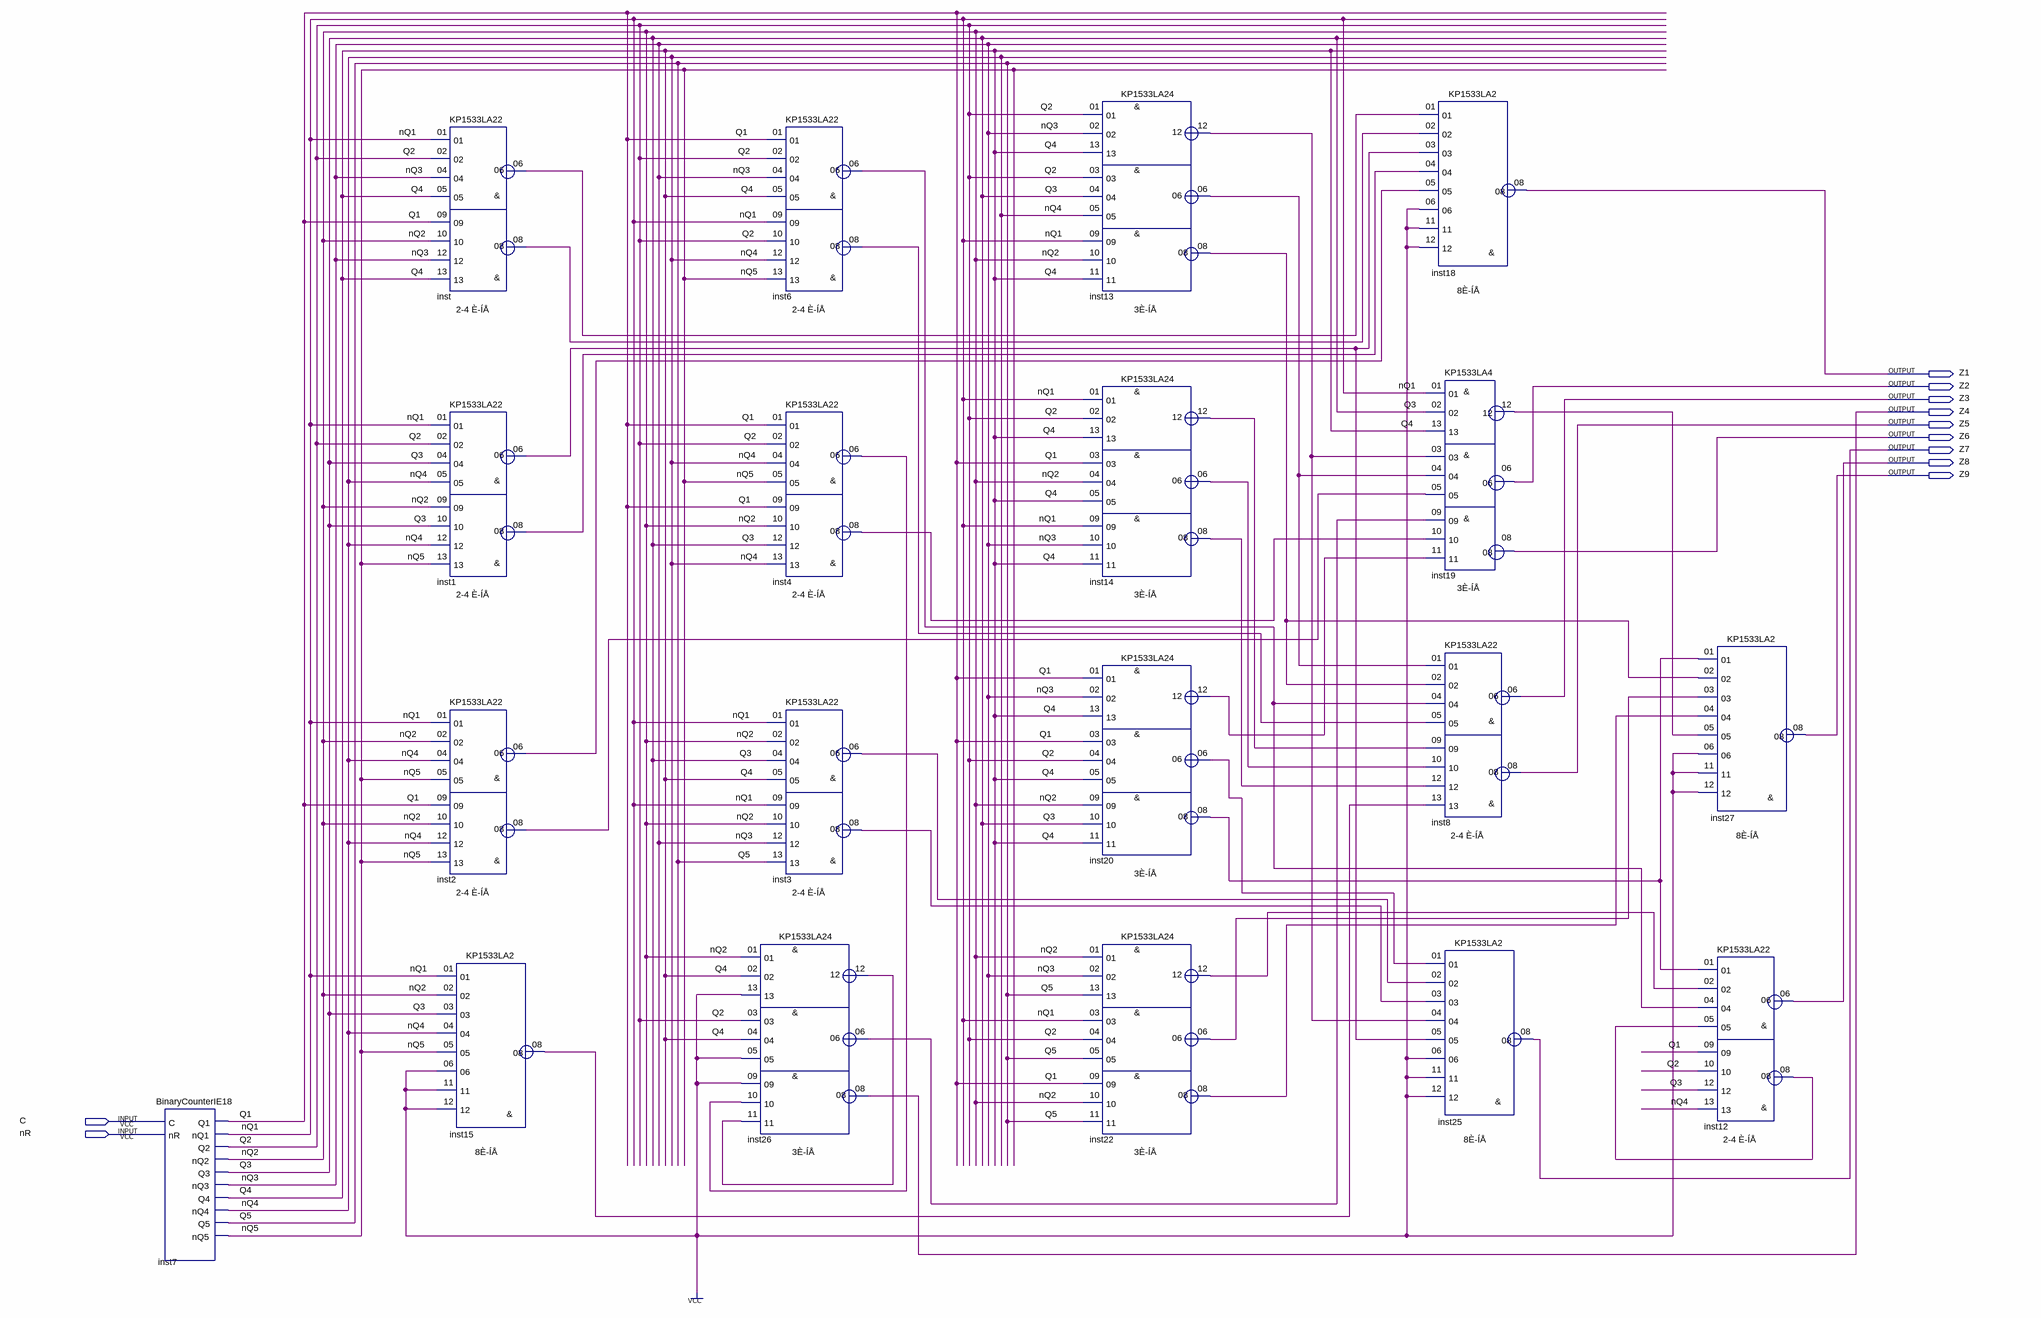
[diagram p0: schematic sheet]
// Quartus schematic PK_NAND.bdf as structural Verilog: 19 symbols, 11 pins
module PK_NAND (
  input  C,
  input  nR,
  output Z1,
  output Z2,
  output Z3,
  output Z4,
  output Z5,
  output Z6,
  output Z7,
  output Z8,
  output Z9
);

  wire inst1_06, inst1_08, inst2_06, inst2_08, inst3_06, inst3_08, inst4_06, inst4_08, inst6_06, inst6_08,
       inst12_08, inst13_06, inst13_08, inst13_12, inst14_06, inst14_08, inst14_12, inst15_08, inst19_12,
       inst20_06, inst20_08, inst20_12, inst22_06, inst22_08, inst22_12, inst26_06, inst26_12, inst_06,
       inst_08, nQ1, nQ2, nQ3, nQ4, nQ5, Q1, Q2, Q3, Q4, Q5;

  BinaryCounterIE18 inst7 (
    .C(C), .nR(nR), .Q1(Q1), .nQ1(nQ1), .Q2(Q2), .nQ2(nQ2), .Q3(Q3), .nQ3(nQ3), .Q4(Q4), .nQ4(nQ4), .Q5(Q5),
    .nQ5(nQ5));
  KP1533LA22 inst (
    .\01 (nQ1), .\02 (Q2), .\04 (nQ3), .\05 (Q4), .\09 (Q1), .\10 (nQ2), .\12 (nQ3), .\13 (Q4),
    .\06 (inst_06), .\08 (inst_08));
  KP1533LA22 inst1 (
    .\01 (nQ1), .\02 (Q2), .\04 (Q3), .\05 (nQ4), .\09 (nQ2), .\10 (Q3), .\12 (nQ4), .\13 (nQ5),
    .\06 (inst1_06), .\08 (inst1_08));
  KP1533LA22 inst2 (
    .\01 (nQ1), .\02 (nQ2), .\04 (nQ4), .\05 (nQ5), .\09 (Q1), .\10 (nQ2), .\12 (nQ4), .\13 (nQ5),
    .\06 (inst2_06), .\08 (inst2_08));
  KP1533LA2 inst15 (
    .\01 (nQ1), .\02 (nQ2), .\03 (Q3), .\04 (nQ4), .\05 (nQ5), .\06 (1'b1), .\11 (1'b1), .\12 (1'b1),
    .\08 (inst15_08));
  KP1533LA22 inst6 (
    .\01 (Q1), .\02 (Q2), .\04 (nQ3), .\05 (Q4), .\09 (nQ1), .\10 (Q2), .\12 (nQ4), .\13 (nQ5),
    .\06 (inst6_06), .\08 (inst6_08));
  KP1533LA22 inst4 (
    .\01 (Q1), .\02 (Q2), .\04 (nQ4), .\05 (nQ5), .\09 (Q1), .\10 (nQ2), .\12 (Q3), .\13 (nQ4),
    .\06 (inst4_06), .\08 (inst4_08));
  KP1533LA22 inst3 (
    .\01 (nQ1), .\02 (nQ2), .\04 (Q3), .\05 (Q4), .\09 (nQ1), .\10 (nQ2), .\12 (nQ3), .\13 (Q5),
    .\06 (inst3_06), .\08 (inst3_08));
  KP1533LA24 inst26 (
    .\01 (nQ2), .\02 (Q4), .\13 (1'b1), .\03 (Q2), .\04 (Q4), .\05 (1'b1), .\09 (1'b1), .\10 (inst4_06),
    .\11 (inst26_12), .\12 (inst26_12), .\06 (inst26_06), .\08 (Z4));
  KP1533LA24 inst13 (
    .\01 (Q2), .\02 (nQ3), .\13 (Q4), .\03 (Q2), .\04 (Q3), .\05 (nQ4), .\09 (nQ1), .\10 (nQ2), .\11 (Q4),
    .\12 (inst13_12), .\06 (inst13_06), .\08 (inst13_08));
  KP1533LA24 inst14 (
    .\01 (nQ1), .\02 (Q2), .\13 (Q4), .\03 (Q1), .\04 (nQ2), .\05 (Q4), .\09 (nQ1), .\10 (nQ3), .\11 (Q4),
    .\12 (inst14_12), .\06 (inst14_06), .\08 (inst14_08));
  KP1533LA24 inst20 (
    .\01 (Q1), .\02 (nQ3), .\13 (Q4), .\03 (Q1), .\04 (Q2), .\05 (Q4), .\09 (nQ2), .\10 (Q3), .\11 (Q4),
    .\12 (inst20_12), .\06 (inst20_06), .\08 (inst20_08));
  KP1533LA24 inst22 (
    .\01 (nQ2), .\02 (nQ3), .\13 (Q5), .\03 (nQ1), .\04 (Q2), .\05 (Q5), .\09 (Q1), .\10 (nQ2), .\11 (Q5),
    .\12 (inst22_12), .\06 (inst22_06), .\08 (inst22_08));
  KP1533LA2 inst18 (
    .\01 (inst_06), .\02 (inst_08), .\03 (inst1_06), .\04 (inst1_08), .\05 (inst2_06), .\06 (1'b1),
    .\11 (1'b1), .\12 (1'b1), .\08 (Z1));
  KP1533LA4 inst19 (
    .\01 (nQ1), .\02 (Q3), .\13 (Q4), .\03 (inst13_12), .\04 (inst13_06), .\05 (inst2_08), .\09 (inst26_06),
    .\10 (inst4_08), .\11 (inst20_12), .\12 (inst19_12), .\06 (Z2), .\08 (Z6));
  KP1533LA22 inst8 (
    .\01 (inst13_06), .\02 (inst13_08), .\04 (inst6_06), .\05 (inst6_08), .\09 (inst14_12), .\10 (inst14_06),
    .\12 (inst14_08), .\13 (inst15_08), .\06 (Z3), .\08 (Z5));
  KP1533LA2 inst25 (
    .\01 (inst20_06), .\02 (inst3_06), .\03 (inst3_08), .\04 (inst13_12), .\05 (inst1_06), .\06 (1'b1),
    .\11 (1'b1), .\12 (1'b1), .\08 (Z7));
  KP1533LA2 inst27 (
    .\01 (inst20_08), .\02 (inst13_08), .\03 (inst22_06), .\04 (inst22_08), .\05 (inst19_12), .\06 (1'b1),
    .\11 (1'b1), .\12 (1'b1), .\08 (Z9));
  KP1533LA22 inst12 (
    .\01 (inst20_08), .\02 (inst22_12), .\04 (inst6_06), .\05 (inst12_08), .\09 (Q1), .\10 (Q2), .\12 (Q3),
    .\13 (nQ4), .\06 (Z8), .\08 (inst12_08));
endmodule
